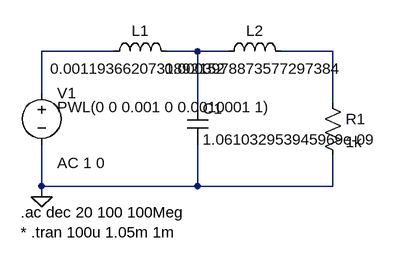
[diagram p0: schematic 3_butter_lpf.asc]
3_butter_lpf.asc, the LTspice schematic file:
Version 4
SHEET 1 880 680
WIRE 128 80 16 80
WIRE 256 80 208 80
WIRE 304 80 256 80
WIRE 464 80 384 80
WIRE 16 144 16 80
WIRE 256 160 256 80
WIRE 464 160 464 80
WIRE 16 288 16 224
WIRE 256 288 256 224
WIRE 256 288 16 288
WIRE 464 288 464 240
WIRE 464 288 256 288
WIRE 16 304 16 288
FLAG 16 304 0
SYMBOL voltage 16 128 R0
WINDOW 123 24 124 Left 2
WINDOW 39 0 0 Left 2
WINDOW 3 24 38 Left 2
SYMATTR Value2 AC 1 0
SYMATTR InstName V1
SYMATTR Value PWL(0 0 0.001 0 0.0010001 1)
SYMBOL cap 240 160 R0
SYMATTR InstName C1
SYMATTR Value 1.061032953945969e-09
SYMBOL ind 112 96 R270
WINDOW 0 32 56 VTop 2
WINDOW 3 5 56 VBottom 2
SYMATTR InstName L1
SYMATTR Value 0.0011936620731892152
SYMBOL ind 288 96 R270
WINDOW 0 32 56 VTop 2
WINDOW 3 5 56 VBottom 2
SYMATTR InstName L2
SYMATTR Value 0.0003978873577297384
SYMBOL res 448 144 R0
SYMATTR InstName R1
SYMATTR Value 1k
TEXT -16 328 Left 2 !.ac dec 20 100 100Meg\n* .tran 100u 1.05m 1m

The netlist it stands for:
* 3_butter_lpf.asc
V1 N001 0 PWL(0 0 0.001 0 0.0010001 1) AC 1 0
C1 N002 0 1.061032953945969e-09
L1 N001 N002 0.0011936620731892152
L2 N002 N003 0.0003978873577297384
R1 N003 0 1k
.ac dec 20 100 100Meg
* .tran 100u 1.05m 1m
.backanno
.end